# EAGLE design 302_bluetooth (EAGLE 7.6.0)
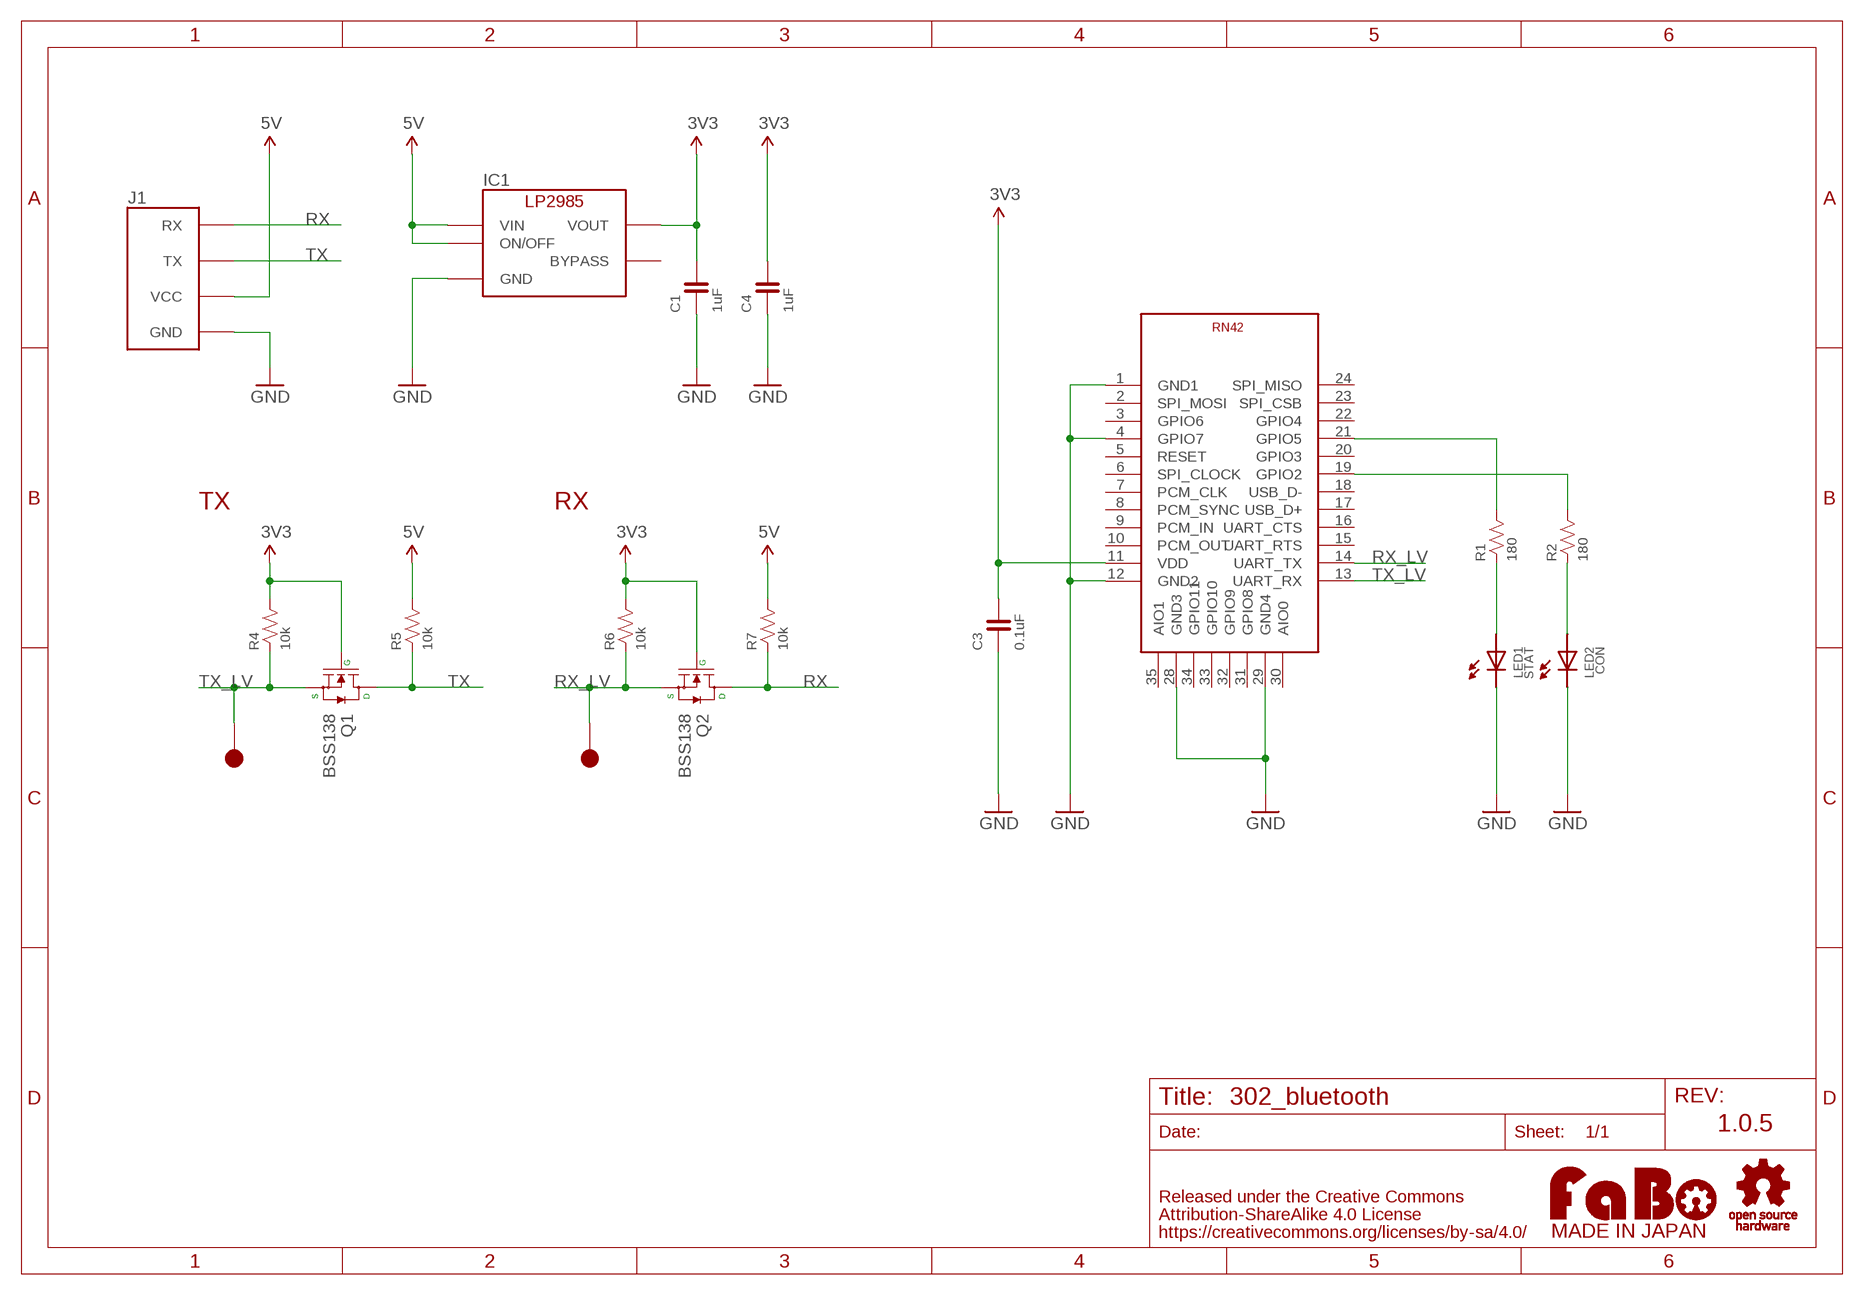
[diagram p0: schematic, sheet 1]

## Parts
C1  1uF  CAPACITOR-0603  [0603]
C3  0.1uF  CAPACITOR-0603  [0603]
C4  1uF  CAPACITOR-0603  [0603]
IC1  LP2985-33DBV  [SOT-23-5]
J1  FABO_BRICK_SERIAL  [FABO_BRICK_SERIAL]
LED1  STAT  LED-0603-NARROW  [0603-NARROW]
LED2  CON  LED-0603-NARROW  [0603-NARROW]
Q1  BSS138  MOSFET-N-BSS138  [SOT23-3]
Q2  BSS138  MOSFET-N-BSS138  [SOT23-3]
R1  180  RESISTOR-0603-NARROW  [0603-NARROW]
R2  180  RESISTOR-0603-NARROW  [0603-NARROW]
R4  10k  RESISTOR-0603-NARROW  [0603-NARROW]
R5  10k  RESISTOR-0603-NARROW  [0603-NARROW]
R6  10k  RESISTOR-0603-NARROW  [0603-NARROW]
R7  10k  RESISTOR-0603-NARROW  [0603-NARROW]
TP10  TP-15  [TP-15]
TP11  TP-15  [TP-15]
U$1  MICROCHIP-RN42  [MICROCHIP-RN42]
U$3  LOGO_FABO-M_BOTTOM  [LOGO_FABO_MS_BOTTOM]
U$4  LOGO_OSHW-M_BOTTOM  [LOGO_OSHW_M_BOTTOM]

## Nets
3V3: C1.2 C3.2 C4.2 IC1.5(VOUT) Q1.1(G) Q2.1(G) R4.2 R6.2 U$1.11(VDD)
5V: IC1.1(VIN) IC1.3(ON/OFF) J1.VCC R5.2 R7.2
GND: C1.1 C3.1 C4.1 IC1.2(GND) J1.GND LED1.CATHODE LED2.CATHODE U$1.1(GND1) U$1.4(GPIO7) U$1.12(GND2) U$1.28(GND3) U$1.29(GND4)
N$1: LED1.ANODE R1.1
N$2: R2.2 U$1.19(GPIO2)
N$3: R1.2 U$1.21(GPIO5)
N$4: LED2.ANODE R2.1
RX: J1.RX Q2.3(D) R7.1
RX_LV: Q2.2(S) R6.1 TP10.1 U$1.14(UART_TX)
TX: J1.TX Q1.3(D) R5.1
TX_LV: Q1.2(S) R4.1 TP11.1 U$1.13(UART_RX)
Unconnected: IC1.4(BYPASS) U$1.2(SPI_MOSI) U$1.3(GPIO6) U$1.5(RESET) U$1.6(SPI_CLOCK) U$1.7(PCM_CLK) U$1.8(PCM_SYNC) U$1.9(PCM_IN) U$1.10(PCM_OUT) U$1.15(UART_RTS) U$1.16(UART_CTS) U$1.17(USB_D+) U$1.18(USB_D-) U$1.20(GPIO3) U$1.22(GPIO4) U$1.23(SPI_CSB) U$1.24(SPI_MISO) U$1.30(AIO0) U$1.31(GPIO8) U$1.32(GPIO9) U$1.33(GPIO10) U$1.34(GPIO11) U$1.35(AIO1)

## Notes on the sheet
- TX | RX
- 1.0.5

## Library data of the parts
C1 C3 C4 = FaBo-Capacitor:CAPACITOR: CAPACITOR
IC1 = FaBo-Supply:LP2985: LP2985
J1 = FaBo-Template:FABO_BRICK_SERIAL: FaBo Brick Serial
LED1 LED2 = FaBo-LED:LED
Q1 Q2 = FaBo-etc:MOSFET-N
R1 R2 R4-R7 = FaBo-Resistors:RESISTOR: RESISTOR
TP10 TP11 = FaBo-Supply:TP
U$1 = FaBo-BT:MICROCHIP-RN42
U$3 = FaBo-etc:LOGO_FABO
U$4 = FaBo-etc:LOGO_OSHW

## Board
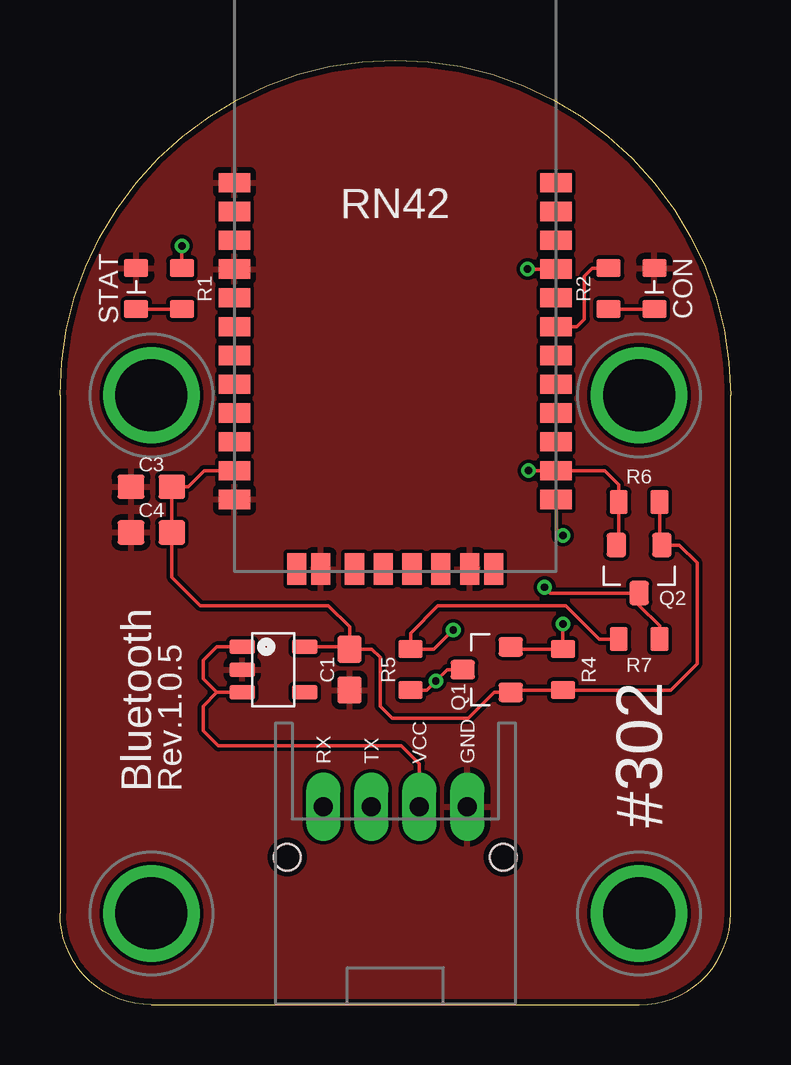
[diagram p1: board, top side]
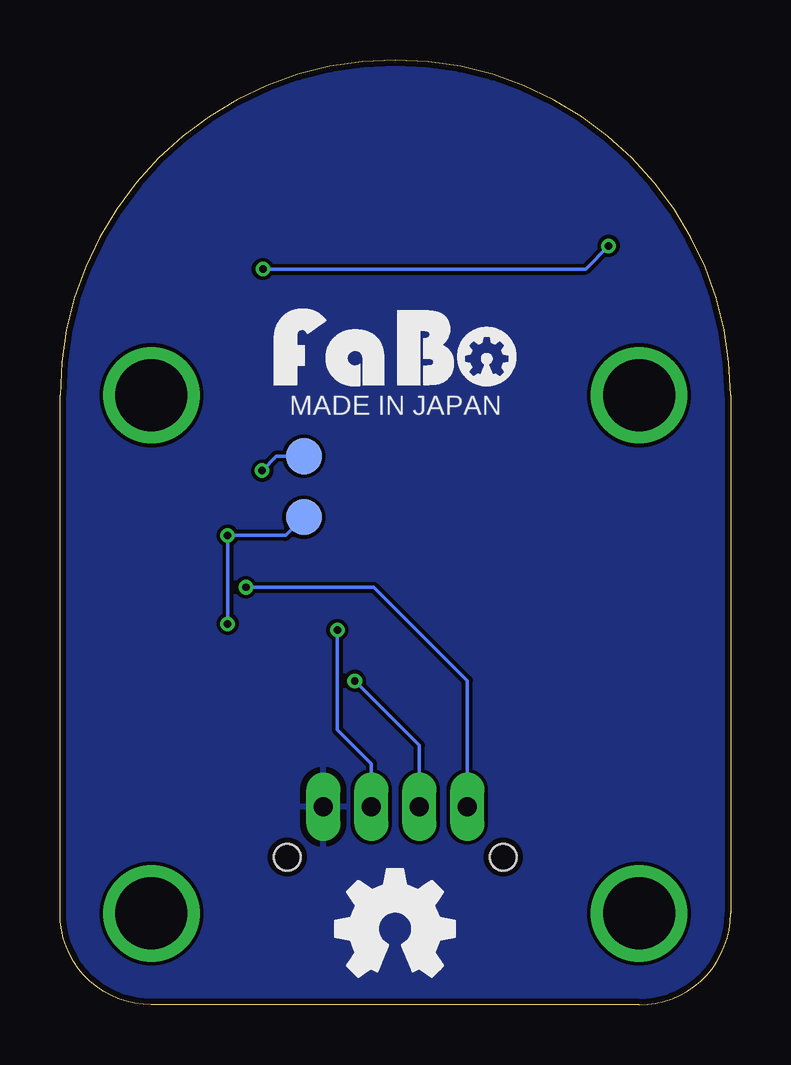
[diagram p2: board, bottom side, seen from below]

Size 27.94 x 39.37 mm. Coordinates in mm from the lower left corner, seen from the top.
Copper layers (1*16): Top 0.035mm / dielectric 1.5mm / Bottom 0.035mm
Design rules "SeeedStudio_2layer_DRU_no_angle_20140221": minimum track width 6mil, minimum drill 12mil, track to track 6mil, track to pad 6mil, pad to pad 6mil, via to via 6mil, smd to smd 0mil, copper to edge 10mil, drill to drill 10mil, minimum pad ring 10mil, minimum via ring 6mil, stop-mask expansion 2mil, vias tented up to drill 100mil, thermal gap 10mil

### Footprints (pad centres in the part's own frame; a part is rotated, then mirrored left to right if it is on the bottom)
0603 = smd 1.1 x 1: 1 -0.85,0; 2 0.85,0
SOT-23-5 = smd 0.6 x 1.05: 1 -0.95,-1.3; 2 0,-1.3; 3 0.95,-1.3; 4 0.95,1.3; 5 -0.95,1.3
FABO_BRICK_SERIAL = drill 0.8 pad 1.422 long: GND 3,-10.795; RX -3,-10.795; TX -1,-10.795; VCC 1,-10.795 | drill 3 pad 3.81: P$1 -10.16,6.35; P$2 10.16,6.35; P$3 -10.16,-15.24; P$4 10.16,-15.24 | hole 1.1: -4.5,-12.895; 4.5,-12.895
0603-NARROW = smd 0.75 x 1: ANODE -0.85,0; CATHODE 0.85,0
SOT23-3 = smd 0.8 x 1: 1 -0.95,-1; 2 0.95,-1; 3 0,1
0603-NARROW' = smd 0.75 x 1: 1 -0.85,0; 2 0.85,0
TP-15 = smd 1.5 x 1.5: 1 0,0
MICROCHIP-RN42 = smd 1.3 x 0.8: 1 -6.7,3.4; 2 -6.7,2.2; 3 -6.7,1; 4 -6.7,-0.2; 5 -6.7,-1.4; 6 -6.7,-2.6; 7 -6.7,-3.8; 8 -6.7,-5; 9 -6.7,-6.2; 10 -6.7,-7.4; 11 -6.7,-8.6; 12 -6.7,-9.8; 13 6.7,-9.8; 14 6.7,-8.6; 15 6.7,-7.4; 16 6.7,-6.2; 17 6.7,-5; 18 6.7,-3.8; 19 6.7,-2.6; 20 6.7,-1.4; 21 6.7,-0.2; 22 6.7,1; 23 6.7,2.2; 24 6.7,3.4 | smd 0.8 x 1.3: 28 3.1,-12.7; 29 -3.1,-12.7; 30 4.1,-12.7; 31 1.9,-12.7; 32 0.7,-12.7; 33 -0.5,-12.7; 34 -1.7,-12.7; 35 -4.1,-12.7

### Placement (x,y rotation side)
C1  12.06,13.97 90 top
C3  3.81,21.59 0 top
C4  3.81,19.68 0 top
IC1  8.89,13.97 270 top
J1  13.97,19.05 0 top
LED1  3.17,29.84 90 top
LED2  24.77,29.84 90 top
Q1  17.78,13.97 90 top
Q2  24.13,18.16 180 top
R1  180  [0603-NARROW']  5.08,29.84 90 top
R2  180  [0603-NARROW']  22.86,29.84 90 top
R4  10k  [0603-NARROW']  20.95,13.97 270 top
R5  10k  [0603-NARROW']  14.61,13.97 90 top
R6  10k  [0603-NARROW']  24.13,20.95 0 top
R7  10k  [0603-NARROW']  24.13,15.24 180 top
TP10  17.78,22.86 0 bottom
TP11  17.78,20.32 0 bottom
U$1  13.97,30.86 0 top
U$3  13.97,25.4 0 top
U$4  13.97,3.17 0 top

### Tracks (layer width: path | path; a pad name or v marks a point on that pad's centre or on a via)
3V3
  Top 0.152: IC1.5 11.96,14.92 C1.2 | C1.2 12.06,15.75 11.18,16.64 5.84,16.64 4.66,17.82 C4.2 C3.2 5.33,21.59 6,22.26 U$1.11 | R6.2 24.98,19.26 Q2.1 25.8,19.16 26.54,18.41 26.54,14.22 25.44,13.12 R4.2 18.88,13.12 Q1.1 18.1,13.02 17.02,11.94 13.84,11.94 13.34,12.45 13.34,14.48 12.99,14.82 C1.2
5V  (via drill 0.3)
  Top 0.152: IC1.1 6.54,14.92 5.97,14.35 5.97,13.59 6.54,13.02 | IC1.3 6.54,13.02 | J1.VCC 14.97,10.05 14.22,10.79 6.6,10.79 5.97,11.43 5.97,12.45 6.54,13.02 | R7.2 22.48,15.24 21.08,16.64 15.75,16.64 14.61,15.49 R5.2 15.58,14.82 v16.38,15.62
  Bottom 0.152: v16.38,15.62 16.38,11.46 14.97,10.05 J1.VCC
GND
  pour Bottom: 0,0 27.94,0 27.94,39.37 0,39.37
  pour Top: 0,0 27.94,0 27.94,39.37 0,39.37
N$1
  Top 0.152: LED1.ANODE R1.1
N$2
  Top 0.152: U$1.19 21.53,28.26 21.84,28.57 21.84,30.35 22.19,30.7 R2.2
N$3  (via drill 0.3)
  Top 0.152: U$1.21 v19.48,30.66 | v5.08,31.62 R1.2
  Bottom 0.152: v19.48,30.66 6.04,30.66 v5.08,31.62
N$4
  Top 0.152: R2.1 LED2.ANODE
RX  (via drill 0.3)
  Top 0.152: R7.1 24.98,15.79 24.13,16.64 Q2.3 20.43,17.16 v20.19,17.4
  Bottom 0.152: J1.RX 10.97,13.51 14.86,17.4 v20.19,17.4
RX_LV  (via drill 0.3)
  Top 0.152: Q2.2 23.28,19.26 R6.1 23.28,21.68 22.7,22.26 U$1.14 v19.52,22.26
  Bottom 0.152: TP10.1 18.92,22.86 v19.52,22.26
TX  (via drill 0.3)
  Top 0.152: Q1.3 16.13,13.97 v15.66,13.5 15.28,13.12 R5.1
  Bottom 0.152: J1.TX 12.97,10.81 v15.66,13.5
TX_LV  (via drill 0.3)
  Top 0.152: Q1.2 18.88,14.82 R4.1 v20.95,15.88 | U$1.13 20.67,19.84 v20.95,19.56
  Bottom 0.152: v20.95,15.88 v20.95,19.56 18.54,19.56 TP11.1

### Text on the board
tPlace: RN42 | STAT | CON | #302 | Bluetooth | Rev.1.0.5
bPlace: MADE IN JAPAN